# EAGLE design LoRa-Bee_v11 (EAGLE 7.7.0)
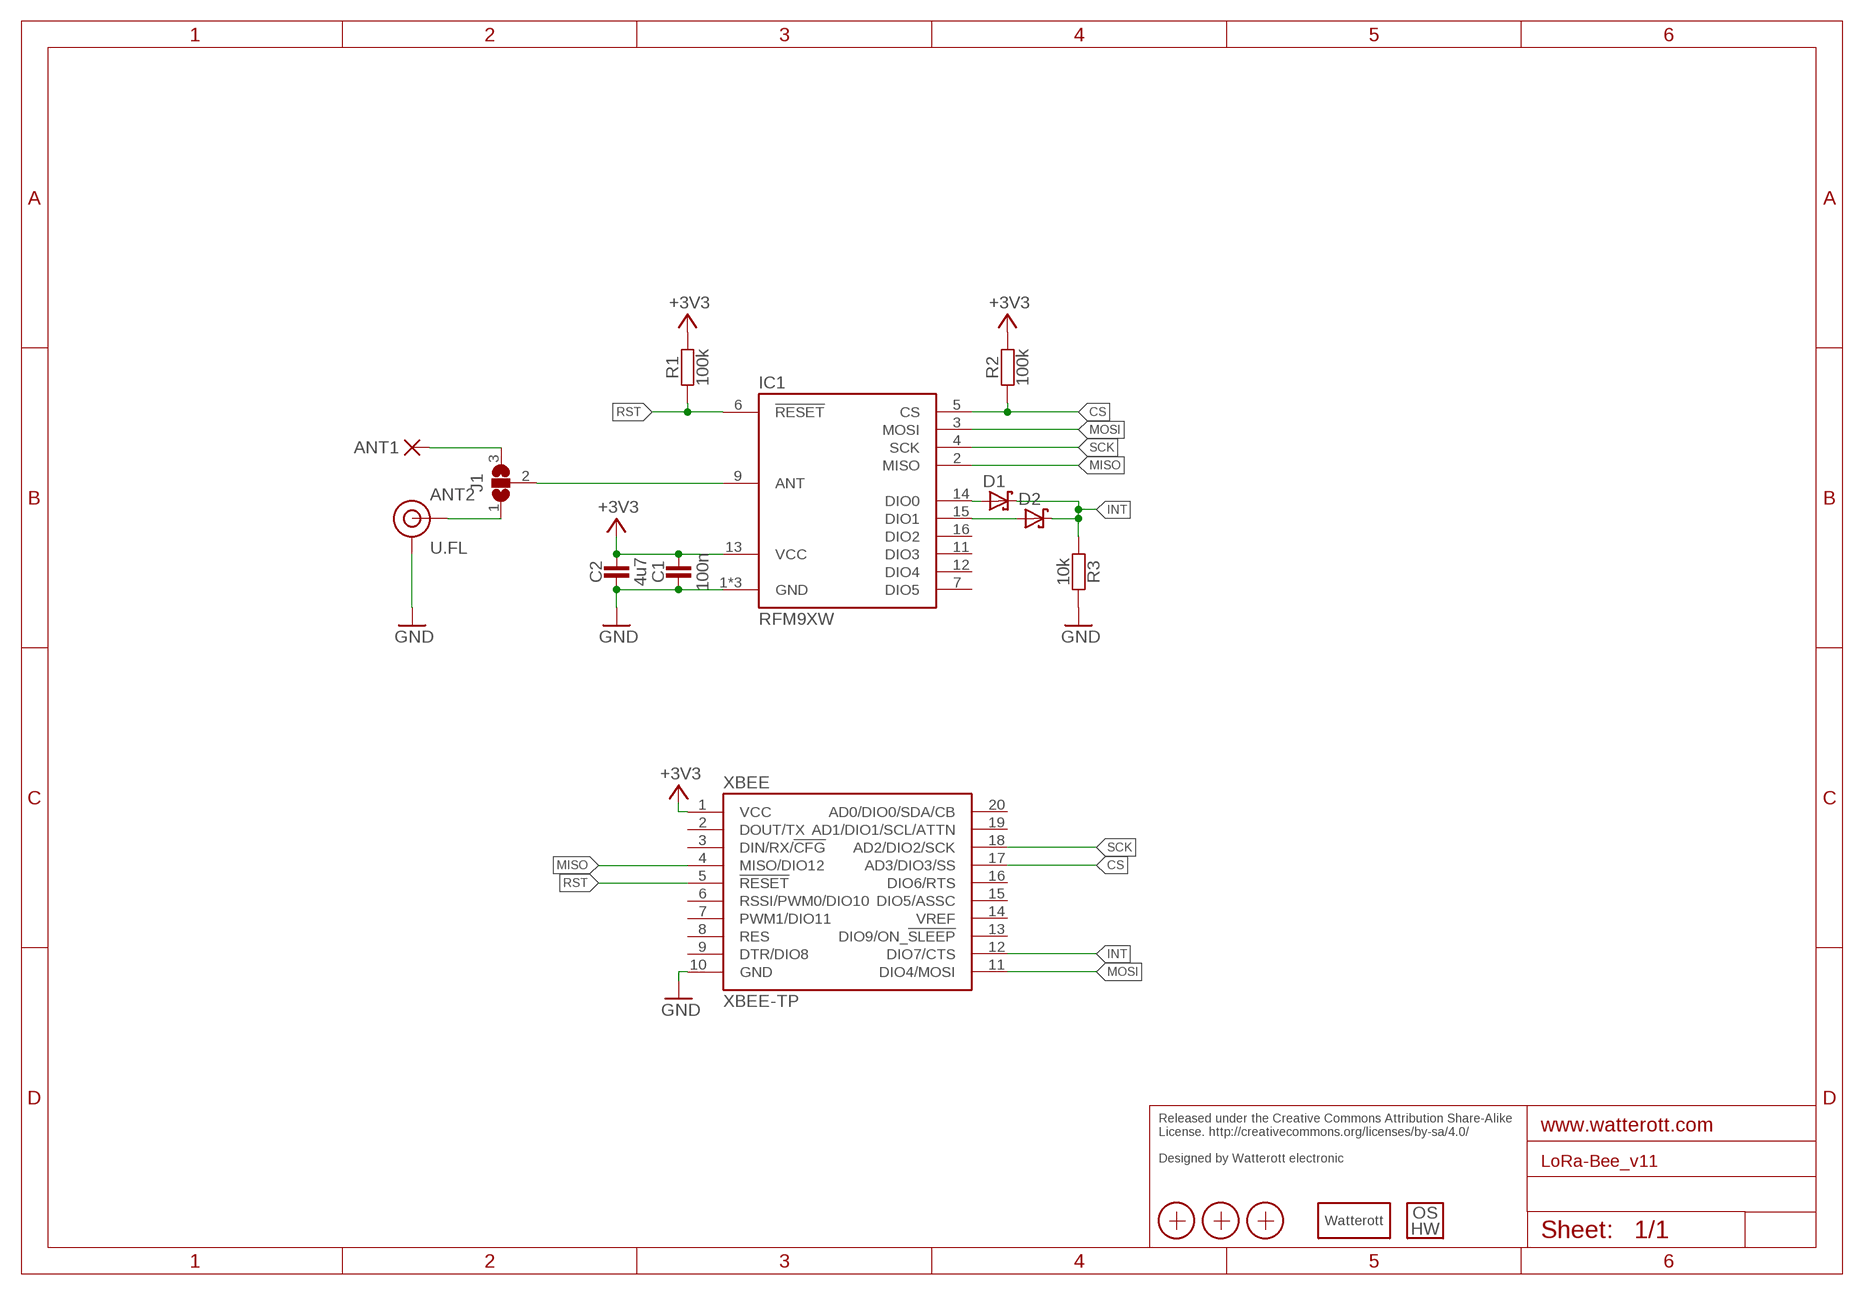
[diagram p0: schematic, sheet 1]

## Parts
ANT1  PAD-1.00-1.60  [PAD-1.00-1.60]
ANT2  U.FL  [U.FL]
C1  100n  CAPACITOR-0402  [C0402]
C2  4u7  CAPACITOR-0402  [C0402]
D1  D_SCHOTTKY-SOD532  [SOD523]
D2  D_SCHOTTKY-SOD532  [SOD523]
IC1  RFM9XW  [RFM9X]
J1  JUMPER3-0603  [JUMPER3-0603]
LOGO3  LOGO_SPARK-2  [SPARK_2MM]
LOGO4  LOGO_OSHW-2  [OSHW_2MM]
R1  100k  RESISTOR-0402  [C0402]
R2  100k  RESISTOR-0402  [C0402]
R3  10k  RESISTOR-0402  [C0402]
X1  PASSER-07  [PASSER_07MM]
X2  PASSER-07  [PASSER_07MM]
X3  PASSER-07  [PASSER_07MM]
XBEE  XBEE-TP  [XBEE_TP]

## Nets
+3V3: C1.2 C2.2 IC1.13(VCC) R1.2 R2.2 XBEE.1(VCC)
ANT: IC1.9(ANT) J1.2
CS: IC1.5(CS) R2.1 XBEE.17(AD3/DIO3/SS)
GND: ANT2.1(GND) ANT2.2(GND) C1.1 C2.1 IC1.1(GND) IC1.8(GND) IC1.10(GND) R3.2 XBEE.10(GND)
INT: D1.C D2.C R3.1 XBEE.12(DIO7/CTS)
MISO: IC1.2(MISO) XBEE.4(MISO/DIO12)
MOSI: IC1.3(MOSI) XBEE.11(DIO4/MOSI)
N$1: D1.A IC1.14(DIO0)
N$2: D2.A IC1.15(DIO1)
N$3: ANT2.FEED(SIGNAL) J1.1
N$4: ANT1.1(P) J1.3
RST: IC1.6(!RESET) R1.1 XBEE.5(!RESET!)
SCK: IC1.4(SCK) XBEE.18(AD2/DIO2/SCK)
Unconnected: IC1.7(DIO5) IC1.11(DIO3) IC1.12(DIO4) IC1.16(DIO2) XBEE.2(DOUT/TX) XBEE.3(DIN/RX/!CFG!) XBEE.6(RSSI/PWM0/DIO10) XBEE.7(PWM1/DIO11) XBEE.8(RES) XBEE.9(DTR/DIO8) XBEE.13(DIO9/ON_!SLEEP!) XBEE.14(VREF) XBEE.15(DIO5/ASSC) XBEE.16(DIO6/RTS) XBEE.19(AD1/DIO1/SCL/ATTN) XBEE.20(AD0/DIO0/SDA/CB)

## Notes on the sheet
- Released under the Creative Commons Attribution Share-Alike 
  License. http://creativecommons.org/licenses/by-sa/4.0/
  
  Designed by Watterott electronic

## Library data of the parts
ANT1 = we-rcl:PAD: Pads and Test-Points
ANT2 = we-con:U.FL: U.FL Connector
C1 C2 = we-rcl:CAPACITOR: Capacitors ...2.2uF @ 6.3V -> 0402 ...4.7uF @ 6.3V -> 0603 ...10uF @ 16V -> 0805 ...22uF @ 25V -> 1206
D1 D2 = we-rcl:D_SCHOTTKY: Schottky Diodes 1A, 30V - SOD323 (BAS3010 or CUS10S40) 2A, 30V - SMA/DO214AC 10A,45V - Z5-T (CDBZ5T1045)
IC1 = we-chip:RFM9X: Hope RR FM9xW Lora Module
J1 = we-rcl:JUMPER3: 3 Pin Jumpers
LOGO3 = we-symbol:LOGO_SPARK: Watterott electronic Logo
LOGO4 = we-symbol:LOGO_OSHW: Open-Source-Hardware Logo
R1-R3 = we-rcl:RESISTOR: Resistors all kinds in 0402 and 0603
X1-X3 = we-symbol:PASSER: Fiducial Markers
XBEE = we-board:XBEE: XBEE connector

## Board
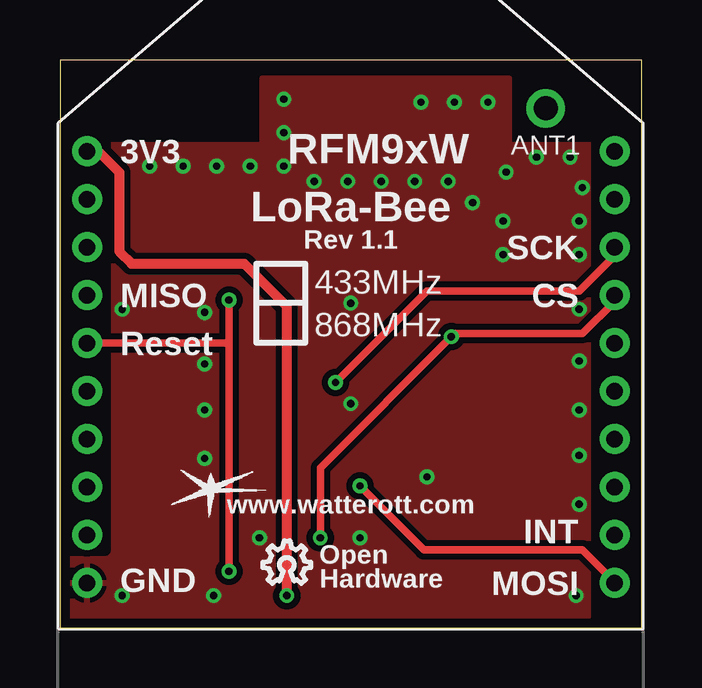
[diagram p1: board, top side]
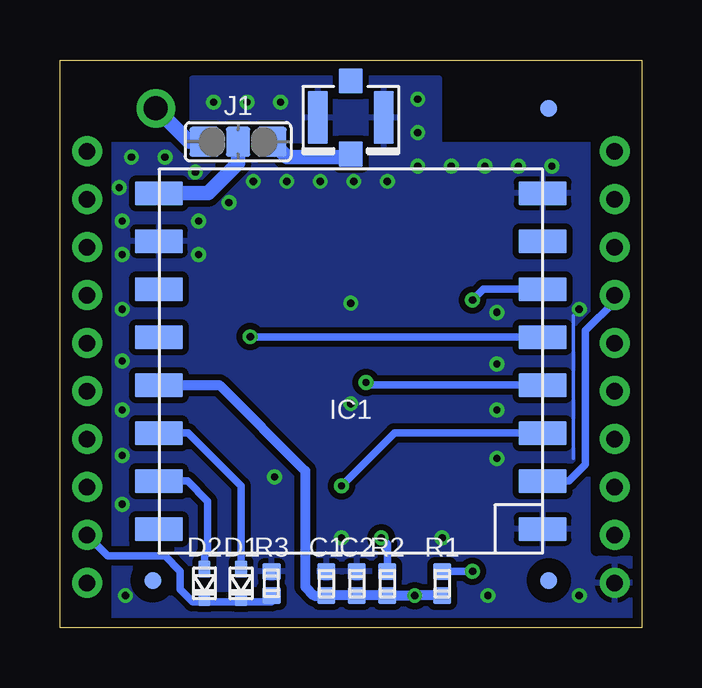
[diagram p2: board, bottom side, seen from below]

Size 24.25 x 23.69 mm. Coordinates in mm from the lower left corner, seen from the top.
Outline: 24.25,0 24.25,23.69 0,23.69 0,0 24.25,0
Copper layers (1*16): Top 0.035mm / dielectric 1.5mm / Bottom 0.035mm
Design rules "we-dru-2-layer *": minimum track width 0.15mm, minimum drill 0.3mm, track to track 0.15mm, track to pad 0.15mm, pad to pad 0.15mm, via to via 0.15mm, smd to smd 0.1mm, copper to edge 0.4mm, drill to drill 0.2mm, minimum pad ring 0.18mm, minimum via ring 0.16mm, stop-mask expansion 0.1mm, vias tented up to drill 0.5mm, thermal gap 0.2mm
tRestrict: area 0.4,3.3 to 1.9,23.3; area 22.4,0.4 to 23.9,23.3
bRestrict: area 0.4,3.3 to 1.9,23.3; area 22.4,0.4 to 23.9,23.3

### Footprints (pad centres in the part's own frame; a part is rotated, then mirrored left to right if it is on the bottom)
PAD-1.00-1.60 = drill 1 pad 1.6: 1 0,0
U.FL = smd 2.2 x 0.85: 1 0,1.375; 2 0,-1.375 | smd 1.05 x 1: FEED 1.525,0; NC -1.525,0
C0402 = smd 0.75 x 0.7: 1 0,0.5; 2 0,-0.5
SOD523 = smd 0.5 x 0.7: A 0,-0.6; C 0,0.6
RFM9X = smd 2 x 1: 1 -8,7; 2 -8,5; 3 -8,3; 4 -8,1; 5 -8,-1; 6 -8,-3; 7 -8,-5; 8 -8,-7; 9 8,-7; 10 8,-5; 11 8,-3; 12 8,-1; 13 8,1; 14 8,3; 15 8,5; 16 8,7
JUMPER3-0603 = smd 1.25 x 1.25: 1 0,1.4; 3 0,-1.4 | smd 1.25 x 1: 2 0,0
PASSER_07MM = smd 0.7 x 0.7: X 0,0
XBEE_TP = drill 0.7 pad 1.25: 1 -11,9; 2 -11,7; 3 -11,5; 4 -11,3; 5 -11,1; 6 -11,-1; 7 -11,-3; 8 -11,-5; 9 -11,-7; 10 -11,-9; 11 11,-9; 12 11,-7; 13 11,-5; 14 11,-3; 15 11,-1; 16 11,1; 17 11,3; 18 11,5; 19 11,7; 20 11,9

### Placement (x,y rotation side)
ANT1  20.25,21.67 0 top
ANT2  12.12,21.29 270 bottom
C1  13.14,1.86 0 bottom
C2  11.87,1.86 0 bottom
D1  16.7,1.86 180 bottom
D2  18.22,1.86 180 bottom
IC1  12.12,11.13 180 bottom
J1  16.82,20.27 270 bottom
LOGO3  6.28,5.79 0 top
LOGO4  9.46,2.75 0 top
R1  8.31,1.86 0 bottom
R2  10.6,1.86 0 bottom
R3  15.43,1.86 180 bottom
X1  3.87,1.98 0 bottom
X2  3.87,21.67 0 bottom
X3  20.38,1.98 0 bottom
XBEE  12.12,10.88 0 top

### Tracks (layer width: path | path; a pad name or v marks a point on that pad's centre or on a via)
+3V3  (via drill 0.3)
  Top 0.406: v9.46,1.35 9.46,13.41 7.68,15.19 2.98,15.19 2.47,15.7 2.47,19 1.6,19.88 XBEE.1
  Bottom 0.406: R1.2 9.45,1.36 v9.46,1.35 10.59,1.35 R2.2 C2.2 12.89,1.36 | 12.89,1.36 C1.2 | IC1.13 17.6,10.13 14.03,6.56 14.03,1.73 13.65,1.35 12.89,1.35 12.89,1.36
ANT
  Bottom 0.61: IC1.9 18.08,18.13 16.82,19.38 J1.2
CS  (via drill 0.3)
  Top 0.305: v10.86,3.76 10.86,6.68 v16.32,12.14 16.44,12.27 21.78,12.27 23.12,13.62 XBEE.17
  Bottom 0.305: R2.1 10.6,3.51 v10.86,3.76 | IC1.5 16.3,12.13 v16.32,12.14
GND  (via drill 0.3)
  Bottom 0.152: 2.85,13.03 2.85,7.06
  other vias: 9.33,19.26 6.03,7.06 18.48,15.57 13.39,18.62 12,18.62 21.65,15.57 10.6,18.62 21.65,16.97 18.48,16.97 21.78,18.37 21.52,1.35 14.79,18.62 2.6,1.35 8.31,3.76 15.3,6.3 7.93,19.26 6.03,9.1 6.03,13.16 2.6,13.29 12.12,9.35 21.65,11.13 21.27,19.64 19.87,19.64 18.6,19 21.65,5.16 21.65,9.1 21.65,7.19 6.03,11 17.2,17.73 16.19,18.62 9.33,20.65 9.33,22.05 15.05,21.92 16.44,21.92 17.84,21.92 6.54,19.26 5.14,19.26 3.74,19.26 6.41,1.35 12.12,13.54 21.65,13.29 12.51,3.76
  pour Top (isolate 0.254): 24.25,0 0,0 0,20.15 8.44,20.15 8.44,22.92 18.73,22.92 18.73,20.15 24.25,20.15
  pour Bottom (isolate 0.254): 0,0 24.25,0 24.25,20.15 18.73,20.15 18.73,22.92 8.44,22.92 8.44,20.15 0,20.15
INT
  Bottom 0.305: 18.22,1.1 16.7,1.1 | 16.7,1.1 15.43,1.1 R3.1 | D1.C 16.7,1.1 | D2.C 18.22,1.1 | 18.22,1.1 18.73,1.1 19.24,1.6 19.24,2.37 19.87,3 22.25,3 XBEE.12
MISO
  Bottom 0.305: IC1.2 3.03,6.13 2.35,6.81 2.35,12.4 1.12,13.62 XBEE.4
  Bottom 0.406: XBEE.4
MOSI  (via drill 0.3)
  Top 0.305: XBEE.11 23.12,1.91 21.78,3.25 15.17,3.25 v12.51,5.92
  Bottom 0.305: IC1.3 10.3,8.13 v12.51,5.92
N$1
  Bottom 0.305: IC1.14 18.9,8.13 16.7,5.92 D1.A
N$2
  Bottom 0.305: IC1.15 18.94,6.13 18.09,5.29 18.09,3.13 18.22,3 D2.A
N$3
  Bottom 0.61: ANT2.FEED 12.12,19.64 14.79,19.64 J1.1
N$4
  Bottom 0.61: J1.3 18.86,20.27 ANT1.1
RST  (via drill 0.3)
  Top 0.305: v7.04,13.67 7.04,11.76 | 7.04,11.76 v7.04,2.37 | XBEE.5 6.93,11.88 7.04,11.76
  Bottom 0.305: IC1.6 6.58,14.13 v7.04,13.67 | v7.04,2.37 R1.1
SCK  (via drill 0.3)
  Top 0.305: v11.49,10.24 15.3,14.05 21.65,14.05 23.12,15.53 XBEE.18
  Bottom 0.305: IC1.4 11.38,10.13 v11.49,10.24

### Text on the board
tPlace: 3V3 | RFM9xW | LoRa-Bee | Rev 1.1 | SCK | MISO | 433MHz | CS | Reset | 868MHz | www.watterott.com | INT | Open | GND | Hardware | MOSI
Reference: Silkscreen: 21 tPlace